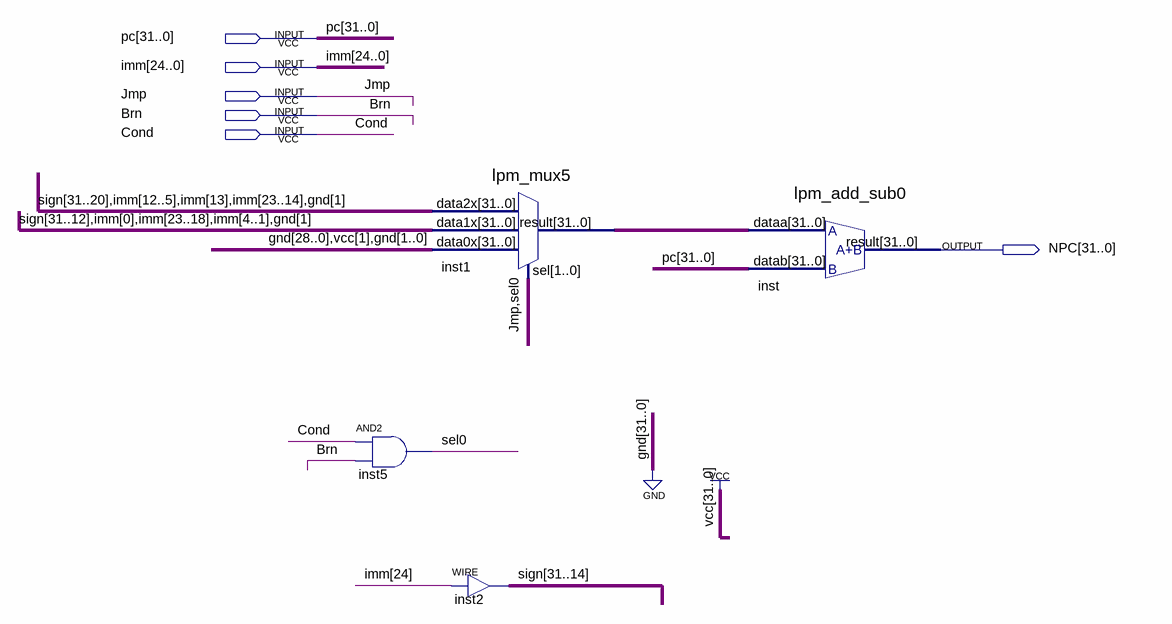
[diagram p0: schematic sheet]
// Quartus schematic ACU.bdf as structural Verilog: 4 symbols, 6 pins
module ACU (
  input  [31:0] pc,
  input  [24:0] imm,
  input  Jmp,
  input  Brn,
  input  Cond,
  output [31:0] NPC
);

  wire sel0;
  wire [31:0] inst1_result;
  wire [31:12] sign;

  and inst5 (sel0, Cond, Brn);
  lpm_mux5 inst1 (
    .data2x({sign[31:20], imm[12:5], imm[13], imm[23:14], 1'b0}),
    .data1x({sign, imm[0], imm[23:18], imm[4:1], 1'b0}), .data0x(32'b00000000000000000000000000000100),
    .sel({Jmp, sel0}), .result(inst1_result));
  assign sign[31:14] = {18{imm[24]}};  // WIRE inst2
  lpm_add_sub0 inst (.dataa(inst1_result), .datab(pc), .result(NPC));
endmodule
